# Altium schematic sheet USB.SchDoc
size A3
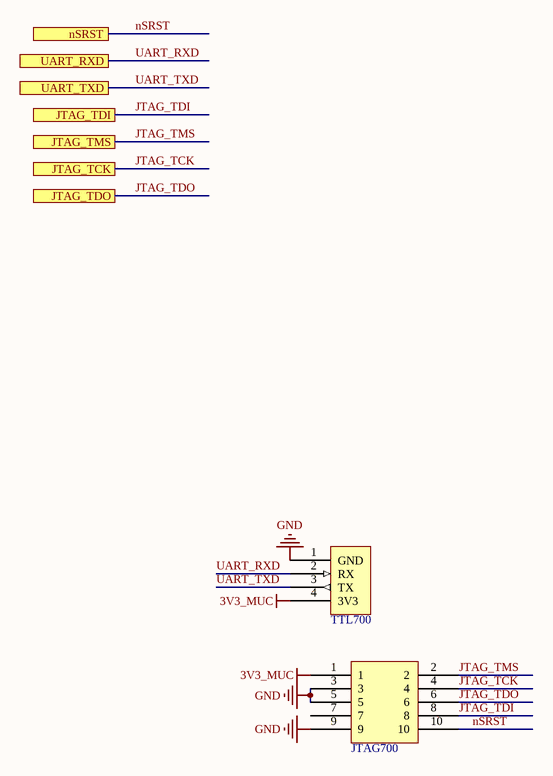
[diagram p0: USB.SchDoc]

## Parts
JTAG700  SHF-105-01-L-D-TH  [SHF-105-01-L-D-TH]  (value not drawn)
TTL700  RS232 Conector TTL  [HDR1X4]  (value not drawn)

## Ports
JTAG_TCK, JTAG_TDI, JTAG_TDO, JTAG_TMS, nSRST, UART_RXD, UART_TXD

## Nets
3V3_MUC: JTAG700.1 TTL700.4(3V3)
GND: JTAG700.3 JTAG700.5 JTAG700.9 TTL700.1(GND)
JTAG_TCK: JTAG700.4 ; port JTAG_TCK
JTAG_TDI: JTAG700.8 ; port JTAG_TDI
JTAG_TDO: JTAG700.6 ; port JTAG_TDO
JTAG_TMS: JTAG700.2 ; port JTAG_TMS
nSRST: JTAG700.10 ; port nSRST
UART_RXD: TTL700.2(RX) ; port UART_RXD
UART_TXD: TTL700.3(TX) ; port UART_TXD

Not connected (* = marked no-connect by the designer): JTAG700 7

## Library data of the parts
JTAG700 = Samtec SHF-105-01-L-D-TH: Samtex 2x5pol; THT 1.27mm; Libary Name: Samtec_Connector.SchLib; Hersteller: Samtec; Part Number: Samtec SHF-105-01-L-D-TH; Footprint Name: SAMTEC_CONNECTORS.PcbLib; Bauteilenummer: SHF-105-01-L-D-TH; quantity Multiplier: 1; Distributor1: Farnell; Teilenummer Distributor1: 1885915; Preis @100 Distributor1: 1,62
TTL700 = Connector - RS232 Conector TTL powered: Stiftleiste; RM:2.54mm; 4 polig einreihig, powered; Libary Name: RS232.SchLib; Hersteller: FCI; Bauteilenummer: 68002-404HLF; Bauteilalternative: oder vergleichbare mechanische Abmessung; Part Number: Connector - RS232 Conector TTL powered; Footprint Name: Miscellaneous Connectors.PcbLib; Footprint: HDR1x4-2.54; quantity Multiplier: 1; HelpURL: http://portal.fciconnect.com/res/en/pdffiles/doc_search//68000.pdf; DatenblattLink: http://portal.fciconnect.com/res/en/pdffiles/doc_search//68000.pdf; Distributor1: digikey; Teilenummer Distributor1: 609-3305-ND; Preis @100 Distributor1: 0,0937; Distributor2: Mouser; Teilenummer Distributor2: 649-68002-404HLF; Preis @100 Distributor2: 0,07